# Altium schematic sheet driver0-3.SchDoc
size A4; SheetNumber: 3; SheetTotal: 6
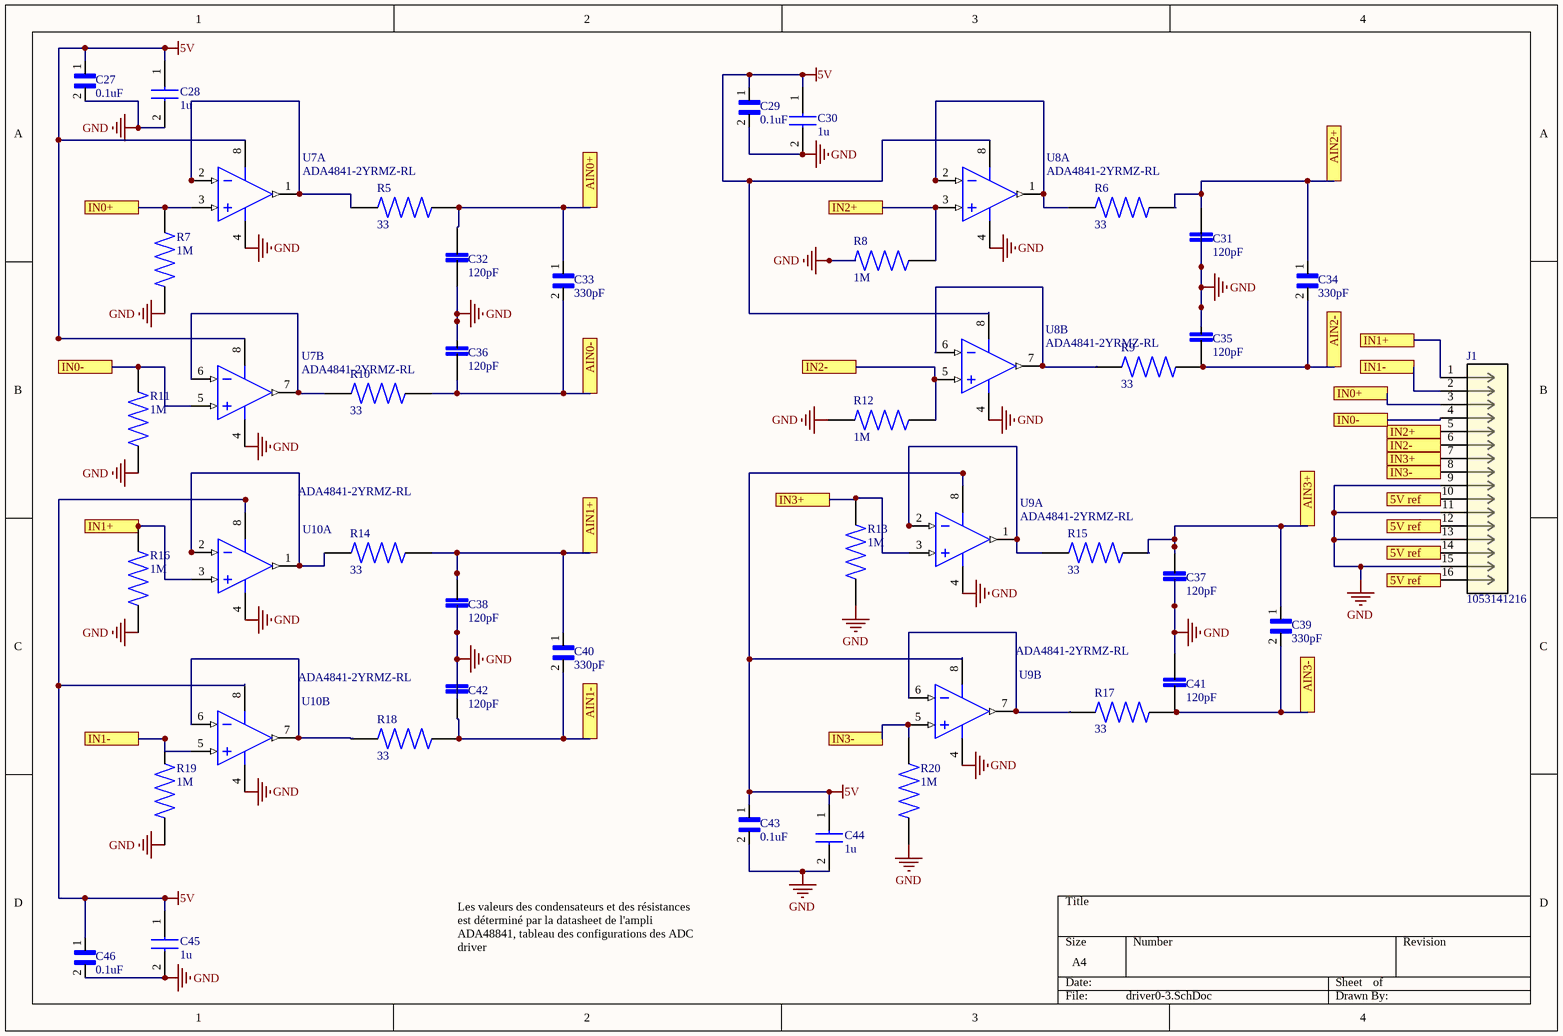
[diagram p0: driver0-3.SchDoc]

## Parts
C27  0.1uF  [CAPC1608X90N]
C28  1u  [CAPC1608X90N]
C29  0.1uF  [CAPC1608X90N]
C30  1u  [CAPC1608X90N]
C31  120pF  [CAPC1608X90]
C32  120pF  [CAPC1608X90]
C33  330pF  [CAPC1608X90]
C34  330pF  [CAPC1608X90]
C35  120pF  [CAPC1608X90]
C36  120pF  [CAPC1608X90]
C37  120pF  [CAPC1608X90]
C38  120pF  [CAPC1608X90]
C39  330pF  [CAPC1608X90]
C40  330pF  [CAPC1608X90]
C41  120pF  [CAPC1608X90]
C42  120pF  [CAPC1608X90]
C43  0.1uF  [CAPC1608X90N]
C44  1u  [CAPC1608X90N]
C45  1u  [CAPC1608X90N]
C46  0.1uF  [CAPC1608X90N]
J1  1053141216  [CON_1053141216]
R5  33  [RESC1608X55N]
R6  33  [RESC1608X55N]
R7  1M  [RESC1608X55N]
R8  1M  [RESC1608X55N]
R9  33  [RESC1608X55N]
R10  33  [RESC1608X55N]
R11  1M  [RESC1608X55N]
R12  1M  [RESC1608X55N]
R13  1M  [RESC1608X55N]
R14  33  [RESC1608X55N]
R15  33  [RESC1608X55N]
R16  1M  [RESC1608X55N]
R17  33  [RESC1608X55N]
R18  33  [RESC1608X55N]
R19  1M  [RESC1608X55N]
R20  1M  [RESC1608X55N]
U7  ADA4841-2YRMZ-RL  [ADI-RM-8_M]  (parts A,B of 2)
U8  ADA4841-2YRMZ-RL  [ADI-RM-8_M]  (parts A,B of 2)
U9  ADA4841-2YRMZ-RL  [ADI-RM-8_M]  (parts A,B of 2)
U10  ADA4841-2YRMZ-RL  [ADI-RM-8_M]  (parts A,B of 2)

## Ports
5V ref, AIN0+, AIN0-, AIN1+, AIN1-, AIN2+, AIN2-, AIN3+, AIN3-, IN0+, IN0-, IN1+, IN1-, IN2+, IN2-, IN3+, IN3-

## Nets
5V: C27.1 C28.1 C29.1 C30.1 C43.1 C44.1 C45.1 C46.1 U7.8(+VS) U8.8(+VS) U9.8(+VS) U10.8(+VS)
GND: C27.2 C28.2 C29.2 C30.2 C31.1 C32.1 C35.2 C36.2 C37.1 C38.1 C41.2 C42.2 C43.2 C44.2 C45.2 C46.2 J1.9 J1.11 J1.13 J1.15 R7.1 R8.2 R11.1 R12.2 R13.1 R16.1 R19.1 R20.1 U7.4(-VS) U8.4(-VS) U9.4(-VS) U10.4(-VS)
5V ref: J1.10 J1.12 J1.14 J1.16 ; port 5V ref
AIN0+: C32.2 C33.1 R5.2 ; port AIN0+
AIN0-: C33.2 C36.1 R10.2 ; port AIN0-
AIN1+: C38.2 C40.1 R14.2 ; port AIN1+
AIN1-: C40.2 C42.1 R18.2 ; port AIN1-
AIN2+: C31.2 C34.1 R6.2 ; port AIN2+
AIN2-: C34.2 C35.1 R9.2 ; port AIN2-
AIN3+: C37.2 C39.1 R15.2 ; port AIN3+
AIN3-: C39.2 C41.1 R17.2 ; port AIN3-
IN0+: J1.3 R7.2 U7.3(+IN_1) ; port IN0+
IN0-: J1.4 R11.2 U7.5(+IN_2) ; port IN0-
IN1+: J1.1 R16.2 U10.3(+IN_1) ; port IN1+
IN1-: J1.2 R19.2 U10.5(+IN_2) ; port IN1-
IN2+: J1.5 R8.1 U8.3(+IN_1) ; port IN2+
IN2-: J1.6 R12.1 U8.5(+IN_2) ; port IN2-
IN3+: J1.7 R13.2 U9.3(+IN_1) ; port IN3+
IN3-: J1.8 R20.2 U9.5(+IN_2) ; port IN3-
NetR5_1: R5.1 U7.1(OUT_1) U7.2(-IN_1)
NetR6_1: R6.1 U8.1(OUT_1) U8.2(-IN_1)
NetR9_1: R9.1 U8.6(-IN_2) U8.7(OUT_2)
NetR10_1: R10.1 U7.6(-IN_2) U7.7(OUT_2)
NetR14_1: R14.1 U10.1(OUT_1) U10.2(-IN_1)
NetR15_1: R15.1 U9.1(OUT_1) U9.2(-IN_1)
NetR17_1: R17.1 U9.6(-IN_2) U9.7(OUT_2)
NetR18_1: R18.1 U10.6(-IN_2) U10.7(OUT_2)

## Notes on the sheet
- Les valeurs des condensateurs et des résistances est déterminé par la datasheet de l'ampli ADA48841, tableau des configurations des ADC driver

## Library data of the parts
C27 C29 C43 C46 = CMP-003-000001-1: Cap Ceramic 0.1uF 25V X5R 10% SMD 0603 85ÂÂŽ T/R; MF: {'manufacturer': u'AVX'}; Price: None; Availability: Unavailable; Value: *; MP: 06033D104KAT2A; Package: None; Component Type: Standard; Design Item ID: 06033D104KAT2A; Pin Count: 2; Source: workerBoard.SCHLIB
C28 C30 C44 C45 = CMP-003-000003-1: Capacitor; Manufacturer_Name: AVX; Datasheet Link: https://componentsearchengine.com/Datasheets/1/06031A100FAT2A.pdf; Height: 0.9mm; Manufacturer_Part_Number: 0603YC105MAT4A; Component Type: Standard; Design Item ID: 0603YC105MAT4A; Pin Count: 2; Source: workerBoard.SCHLIB
C31 C32 C35-C38 C41 C42 = CMP-003-000002-1: 0603 120 pF 50 V Â±2 % Tolerance C0G/NP0 SMT Multilayer Ceramic Capacitor; MF: {'manufacturer': u'AVX'}; Price: None; Availability: Unavailable; Value: *; MP: 06035A121GAT2A; Package: None; Component Type: Standard; Design Item ID: 06035A121GAT2A; Pin Count: 2; Source: workerBoard.SCHLIB
C33 C34 C39 C40 = CMP-003-000000-1: 0603 SMD Ceramic Capacitors 0603 330pF 25volts C0G 2%; MP: 06033A331GAT2A; MF: {'manufacturer': u'AVX'}; Price: None; Availability: Unavailable; Value: *; Package: None; Component Type: Standard; Design Item ID: 06033A331GAT2A; Pin Count: 2; Source: workerBoard.SCHLIB
J1 = CMP-010-000000-1: No Description Available; Mfr_Name: Molex Connector Corporation; Copyright: Copyright (C) 2021 Ultra Librarian. All rights reserved.; Manufacturer_Part_Number: 1053141216; Digi-Key_Part_Number_1: WM15165-ND; RefDes: RefDes; Type: DEV; Component Type: Standard; Design Item ID: 1053141216; Pin Count: 16; Source: workerBoard.SCHLIB
R5 R6 R9 R10 R14 R15 R17 R18 = CMP-008-000006-1: RES SMD 33 OHM 0.1% 1/10W 0603; MP: RT0603BRD0733RL; MF: {'manufacturer': u'Yageo'}; Price: None; Availability: Unavailable; Value: *; Package: None; Component Type: Standard; Design Item ID: RT0603BRD0733RL_2; Pin Count: 2; Source: workerBoard.SCHLIB
R7 R8 R11-R13 R16 R19 R20 = CMP-008-000007-1: MP: RT0603DRD071ML; MF: {'manufacturer': u'Yageo'}; Price: None; Availability: Unavailable; Value: *; Package: None; Component Type: Standard; Design Item ID: RT0603DRD071ML; Pin Count: 2; Source: workerBoard.SCHLIB
U7-U10 = CMP-007-000000-1: Double Channel Low Wide Band Noise Operational Amplifier, 80 MHz BW, 13 V/us SR, Industrial, 8-pin SOP (RM-8), Reel; Manufacturer: Analog Devices; Slew Rate: 13V/us; Iq/Amp: 1.5mA; Amplifiers Per Package: 2; Small Signal Bandwidth: 80MHz; V Span Min: 2.7V; V Span Max: 12V; Input Offset Voltage: 40uV; Input Bias Current: 3uA; ComponentLink3URL: http://www.analog.com/static/imported-files/packages/PKG_PDF/MSOP%28RM%29/RM_8.pdf; PartNumber: ADA4841-2YRMZ-RL; Mounting Technology: Surface Mount; DatasheetVersion: Rev. E; PackageDescription: 8-Pin Mini Small Outline Package, Body 3 x 3 mm, Pitch 0.65 mm; PackageReference: RM-8; ComponentLink2URL: http://www.analog.com/static/imported-files/data_sheets/ADA4841-1_4841-2.pdf; ComponentLink1Description: Manufacturer URL; ComponentLink2Description: Datasheet; Generic Part Number: ADA4841-2; ComponentLink1URL: http://www.analog.com/en/index.html; Code_JEDEC: MO-187-AA; ComponentLink3Description: Package Specification; Component Type: Standard; Design Item ID: CMP-0384-01677-1; Manufacturer Part Number: ADA4841-2YRMZ-RL; Pin Count: 8; Source: workerBoard.SCHLIB